# EAGLE design uvc_air_filter_psu (EAGLE 6.1)
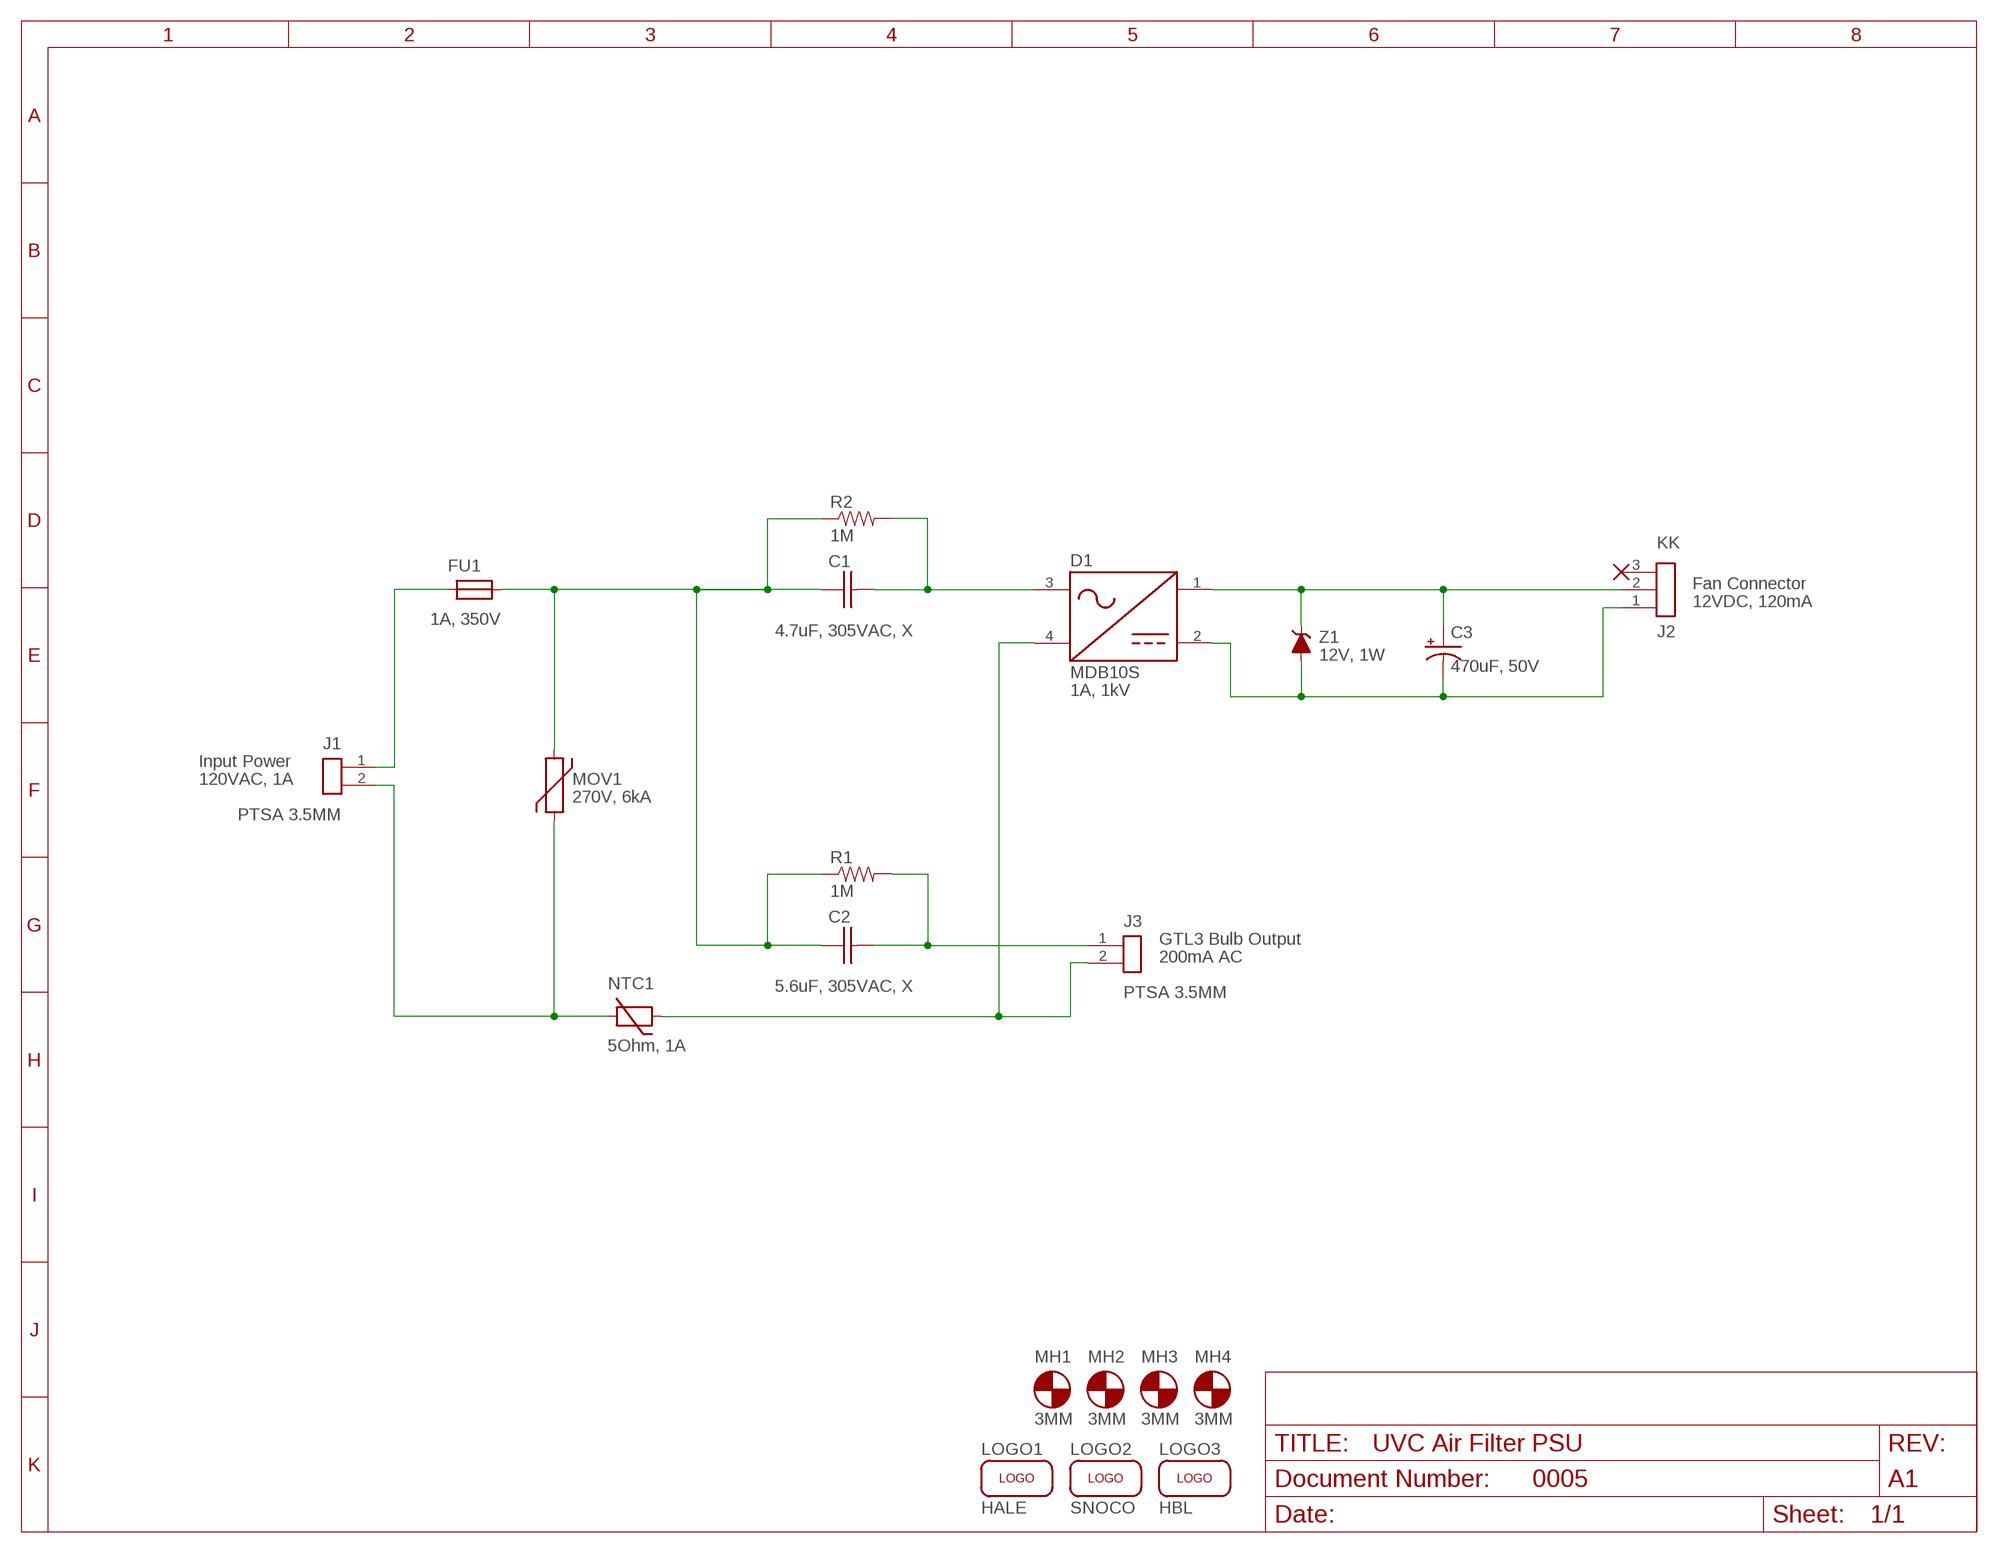
[diagram p0: schematic, sheet 1]
U$2 (NC): _EXTERNAL_: _EXTERNAL_

## Parts
C1  4.7uF, 305VAC, X  C-4.7UF/305VAC-27.5MM  [CAP-27.5MM]
C2  5.6uF, 305VAC, X  C-5.6UF/305VAC-27.5MM  [CAP-27.5MM]
C3  470uF, 50V  C-POL-470UF/50V-10MM  [CAP-5MM-10MM]
D1  1A, 1kV  RECTIFIER-MDB10S-MDB  [TSSOP-4]
FU1  1A, 350V  FUSE-1A-TH-5X15MM  [FUSE-5X15MM]
J1  PTSA 3.5MM  HEADER-1X2-PTSA-3.5MM  [HEADER-PTSA-3.5MM-1X2]
J2  KK  HEADER-1X3-KK  [HEADER-KK-1X3]
J3  PTSA 3.5MM  HEADER-1X2-PTSA-3.5MM  [HEADER-PTSA-3.5MM-1X2]
LOGO1  HALE  LOGO-HALE  [HALE-SILK-ICON]
LOGO2  SNOCO  LOGO-SNOCO  [SNOCO-SILK-ICON]
LOGO3  HBL  LOGO-HACKERBOT  [HACKERBOT-SILK-ICON]
MH1  3MM  MH-M3  [MH-M3]
MH2  3MM  MH-M3  [MH-M3]
MH3  3MM  MH-M3  [MH-M3]
MH4  3MM  MH-M3  [MH-M3]
MOV1  270V, 6kA  MOV-270V/6KA-B722-7.5MM  [MOV-B722-7.5MM]
NTC1  5Ohm, 1A  NTC-5OHM/1A-5MM-TH  [MF72-D5-NTC]
R1  1M  R-15-1206  [1206-NONPOLAR]
R2  1M  R-15-1206  [1206-NONPOLAR]
U$1  FRAME-8.5X11-LANDSCAPE-LET  [FRAME-8.5X11-LANDSCAPE]
Z1  12V, 1W  ZENER-12V/1W-SMA  [SMA]

## Nets
N$1: FU1.1 J1.1
N$2: C1.2(-) D1.3 R2.2
N$3: C1.1(+) C2.1(+) FU1.2 MOV1.1 R1.1 R2.1
N$4: C2.2(-) J3.1 R1.2
N$5: C3.2(-) D1.2(-) J2.1 Z1.1(A)
N$6: C3.1(+) D1.1(+) J2.2 Z1.2(C)
N$7: D1.4 J3.2 NTC1.2
N$8: J1.2 MOV1.2 NTC1.1
Unconnected: J2.3

## Notes on the sheet
- Fan Connector
- 12VDC, 120mA
- Input Power
- 120VAC, 1A
- GTL3 Bulb Output
- 200mA AC

## Library data of the parts
C1 = aaa:C: SMD Capacitor; DIGIKEY: 495-1889-ND; MFG: TDK Electronics Inc.; PN: B32924C3475M000
C2 = aaa:C: SMD Capacitor; DIGIKEY: 495-1890-ND; MFG: TDK Electronics Inc.; PN: B32924C3565M000
C3 = aaa:C-POL: SMD Capacitor (Polarized) Electrolytic/Tantalum; DIGIKEY: P5185-ND; MFG: Panasonic Electronic Components; PN: ECA-1HM471
D1 = aaa:RECTIFIER: Full bridge rectifier; DIGIKEY: MDB10SFSCT-ND; MFG: ON Semiconductor; PN: MDB10S
FU1 = aaa:FUSE: SMD Positive Temperature Coefficent Resistor; DIGIKEY: 1294-0209001.MXEP-CHP; MFG: Littelfuse Inc.; PN: 0209001.MXEP
J1 J3 = aaa:HEADER-1X2; DIGIKEY: 277-1622-ND; MFG: Phoenix Contact; PN: 1985195
J2 = aaa:HEADER-1X3; DIGIKEY: WM4201-ND; MFG: Molex; PN: 0022232031
LOGO1-LOGO3 = aaa:LOGO
MH1-MH4 = aaa:MH: Mounting Hole
MOV1 = aaa:MOV: Metal Oxide Varistor; DIGIKEY: 495-1439-ND; MFG: TDK Electronics Inc.; PN: B72214S2171K101
NTC1 = aaa:NTC: Negative Temperature Coefficent Resistor; DIGIKEY: 570-1262-ND; MFG: Ametherm; PN: SL05 5R001-A
R1 R2 = aaa:R: SMD Resistor; DIGIKEY: 311-1.00MFRCT-ND; MFG: Yageo; PN: RC1206FR-071ML
U$1 = aaa:FRAME-8.5X11-LANDSCAPE; DOCNUM: 0005; REV: A1; TITLE: UVC Air Filter PSU
Z1 = aaa:ZENER: SMD Zener Diode; DIGIKEY: SMAZ12-FDICT-ND; MFG: Diodes Incorporated; PN: SMAZ12-13-F

## Board
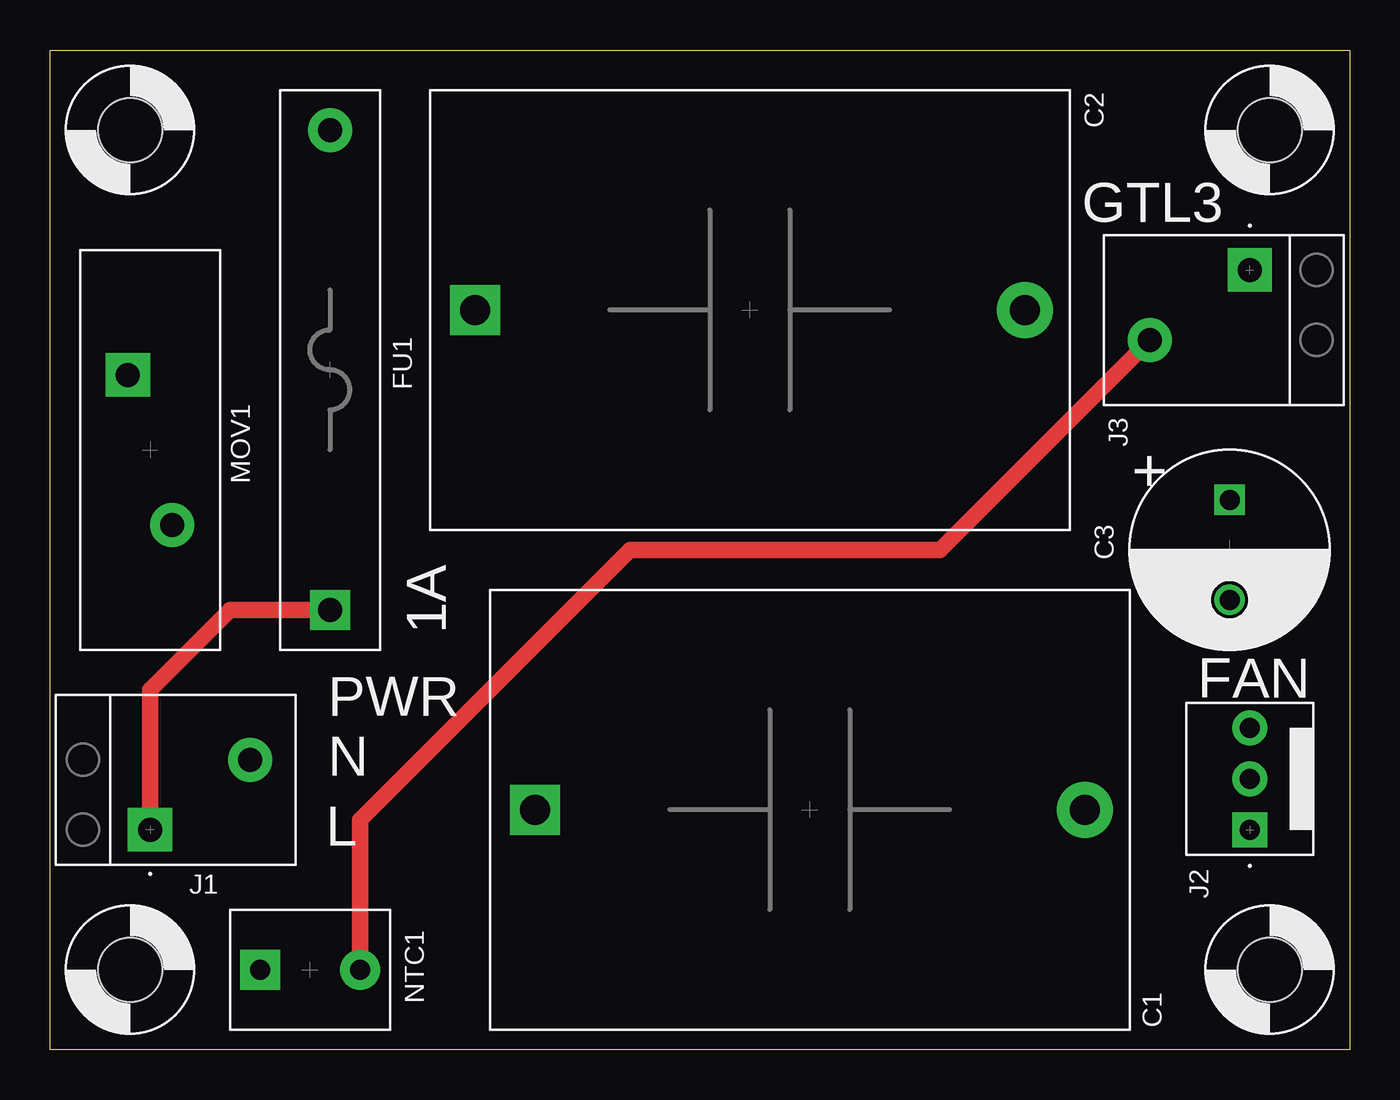
[diagram p1: board, top side]
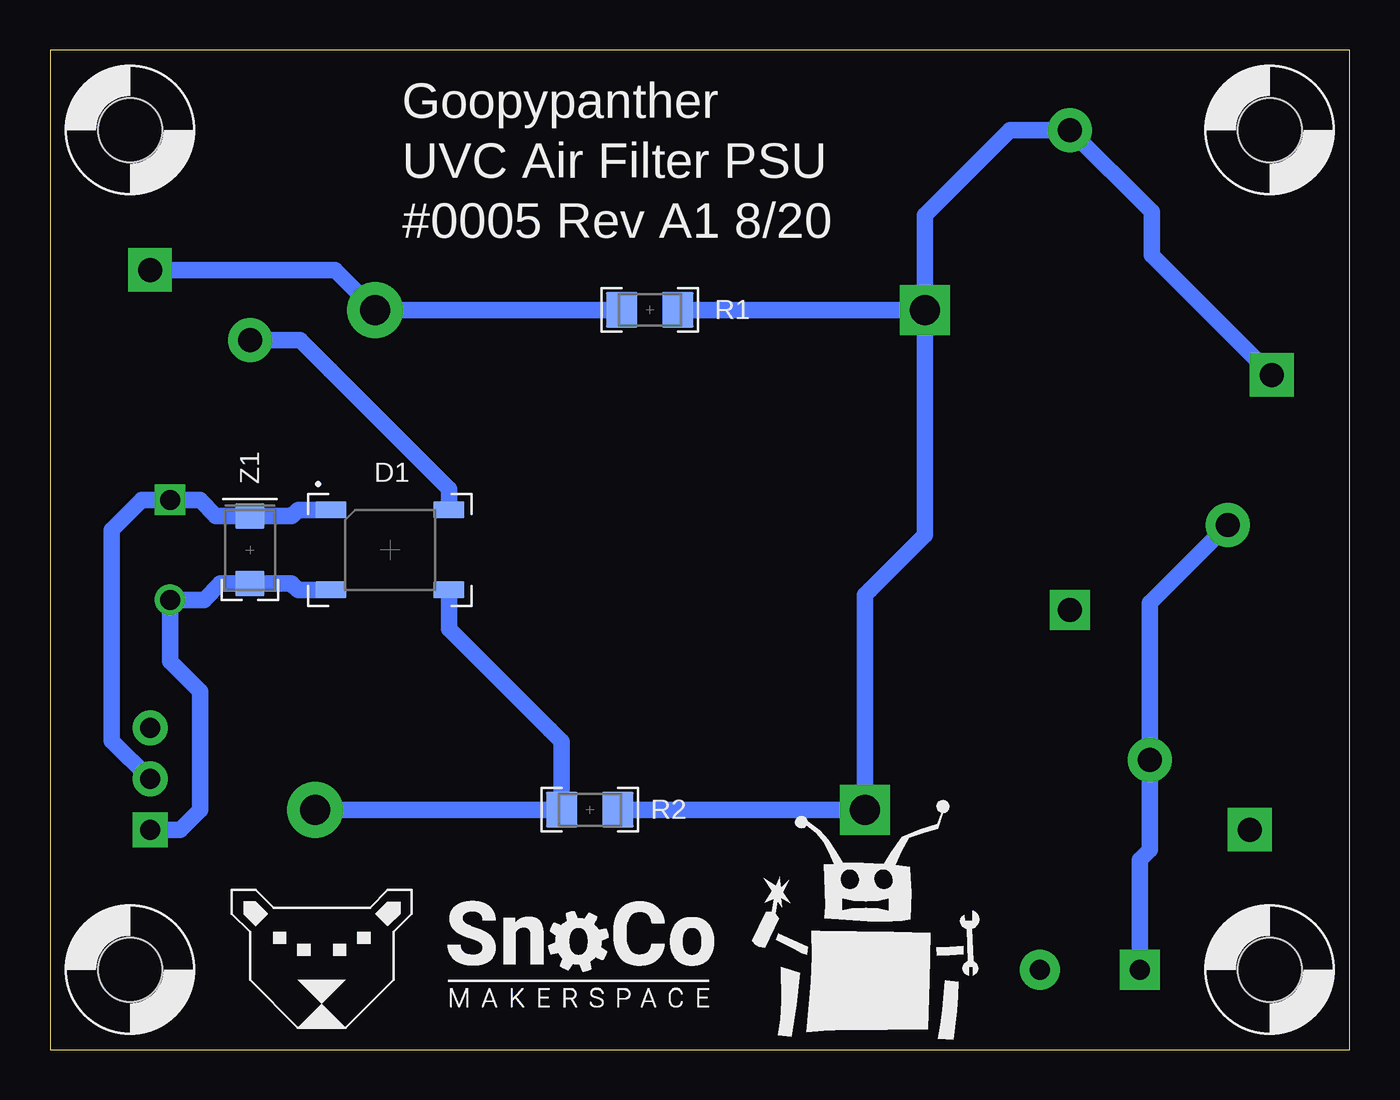
[diagram p2: board, bottom side, seen from below]

Size 65 x 50 mm. Coordinates in mm from the lower left corner, seen from the top.
Outline: 0,50 65,50 65,0 0,0 0,50
Copper layers (1*16): Top 0.035mm / dielectric 1.5mm / Bottom 0.035mm
Design rules: minimum track width 10mil, minimum drill 0.6mm, track to track 8mil, track to pad 8mil, pad to pad 8mil, via to via 8mil, smd to smd 8mil, copper to edge 40mil, drill to drill 8mil, minimum pad ring 10mil, minimum via ring 8mil, stop-mask expansion 4mil, vias tented up to drill 0mil, thermal gap 10mil

### Footprints (pad centres in the part's own frame; a part is rotated, then mirrored left to right if it is on the bottom)
CAP-27.5MM = drill 1.5 pad 2.5 square: 1 -13.75,0 | drill 1.5 pad 2.8: 2 13.75,0
CAP-5MM-10MM = drill 1 square: 1 0,2.5 | drill 1: 2 0,-2.5
TSSOP-4 = smd 0.85 x 1.55: 1 -2,-2.95; 2 2,-2.95; 3 2,2.95; 4 -2,2.95
FUSE-5X15MM = drill 1.2 pad 2 square: 1 -12,0 | drill 1.2 pad 2.2: 2 12,0
HEADER-PTSA-3.5MM-1X2 = drill 1.2 pad 2.2 square: 1 0,0 | drill 1.2 pad 2.2: 2 -3.5,5
HEADER-KK-1X3 = drill 1 pad 1.75 square: 1 0,0 | drill 1 pad 1.75: 2 2.54,0; 3 5.08,0
MH-M3 = hole 3.2: 0,0
MOV-B722-7.5MM = drill 1.2 pad 2.2 square: 1 -3.75,-1.1 | drill 1.2 pad 2.2: 2 3.75,1.1
MF72-D5-NTC = drill 1 pad 2 square: 1 -2.5,0 | drill 1 pad 2: 2 2.5,0
1206-NONPOLAR = smd 1.6 x 1.8: 1 -1.4,0; 2 1.4,0
SMA = smd 1.27 x 1.47: 1 -1.685,0; 2 1.685,0

### Placement (x,y rotation side)
C1  38,12 0 top
C2  35,37 0 top
C3  59,25 0 top
D1  48,25 270 bottom
DRILEGEND  [DRILEGEND]  -41.92,152.17 0 top  (outside the outline)
FU1  14,34 90 top
J1  5,11 270 top
J2  60,11 90 top
J3  60,39 90 top
LOGO1  51.4,2.3 0 bottom
LOGO2  38.5,4.8 0 bottom
LOGO3  24,3.6 0 bottom
MH1  61,46 0 top
MH2  61,4 0 top
MH3  4,46 0 top
MH4  4,4 0 top
MOV1  5,30 270 top
NTC1  13,4 0 top
R1  35,37 180 bottom
R2  38,12 180 bottom
U$1  -56,-56 0 top  (outside the outline)
Z1  55,25 90 bottom

### Tracks (layer width: path | path; a pad name or v marks a point on that pad's centre or on a via)
N$1
  Top 0.813: J1.1 5,18 9,22 FU1.1
N$2
  Bottom 0.813: C1.2 R2.2 39.4,15.4 40,16 45.05,21.05 D1.3
N$3
  Bottom 0.813: 33,37 R1.1 C2.1 | C2.1 21.25,41.75 17,46 FU1.2 9.9,41.9 9.9,39.75 MOV1.1 | C2.1 21.25,25.75 24,23 24.25,22.75 C1.1 R2.1
N$4
  Bottom 0.813: R1.2 C2.2 50.75,39 54,39 J3.1
N$5
  Bottom 0.813: D1.2 52.6,23 52.9,23.3 52.92,23.31 Z1.1 56.48,23.31 57.3,22.5 C3.2 59,19.4 57.5,17.9 57.5,12 58.5,11 J2.1
N$6
  Bottom 0.813: D1.1 52.6,27 52.9,26.7 52.92,26.69 Z1.2 56.69,26.69 56.7,26.7 57.5,27.5 C3.1 60.4,27.5 61.9,26 61.9,18.6 61.9,15.44 J2.2
N$7
  Top 0.813: J3.2 44.5,25 29,25 28.3,24.3 15.5,11.5 NTC1.2
  Bottom 0.813: D1.4 45.05,28.05 51,34 52.5,35.5 J3.2
N$8
  Bottom 0.813: MOV1.2 10,22.35 J1.2 10,10 10.5,9.5 NTC1.1

### Text on the board
Document: Notes: | 1. | Top/component side shown. | Dimension in MM unless otherwise specified. | 2. | Fabricate PCB in accordance with IPC-6012 Class 2. | 3. | Registration: Hole position shall be within 0.2mm | (8mil) of true position. | 4. | All holes shall have a tolerance of +/-0.08mm (3.15mil). | 5. | Material: FR-4 laminate and prepreg per IPC-4101/21. | 35um (1oz) (1.38mil) copper exterior layers. | Board thickness shall be 1.6mm (62mil) +/-0.254mm (10mil). | 6. | Finish: All exposed conductive pattern areas shall be | plated by HASL. | Apply solder mask (green) per IPC-SM-840 Class T | to both sides over bare copper. | Via holes shall not be plugged. | 7. | Silkscreen: White, both sides per MIL-I-43553. | Not to be printed on exposed conductive pattern areas. | # | Name | File | Notes | 1 | Top Stencil | .GTP | 2 | Top Silk | .GTO | 3 | Top Solder Mask | .GTS | 4 | Top Layer | .GTL | 5 | Bottom Layer | .GBL | 6 | Bottom Solder Mask | .GBS | 7 | Bottom Silk | .GBO | 8 | Bottom Stencil | .GBP | 9 | Board Outline | .GKO | 10 | Drills | .XLN | 11 | Drill Drawing | .GD1 | 12 | Documentation | .GD2
tSilk: GTL3 | 1A | FAN | PWR | N | L
bSilk: Goopypanther | UVC Air Filter PSU | #0005 Rev A1 8/20
DrillLegend_01-16: 01-16
DrillLegend_01-20: 01-20